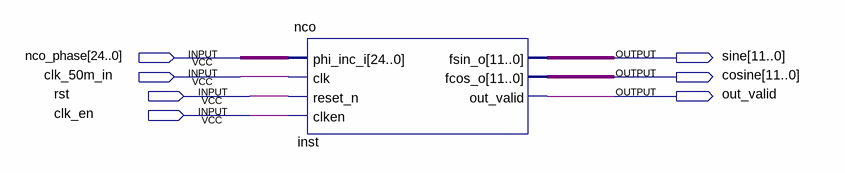
[diagram p0: schematic sheet]
// Quartus schematic nco_test.bdf as structural Verilog: 1 symbols, 7 pins
module nco_test (
  input  [24:0] nco_phase,
  input  clk_50m_in,
  input  rst,
  input  clk_en,
  output [11:0] sine,
  output [11:0] cosine,
  output out_valid
);

  nco inst (
    .phi_inc_i(nco_phase), .clk(clk_50m_in), .reset_n(rst), .clken(clk_en), .fsin_o(sine), .fcos_o(cosine),
    .out_valid(out_valid));
endmodule
